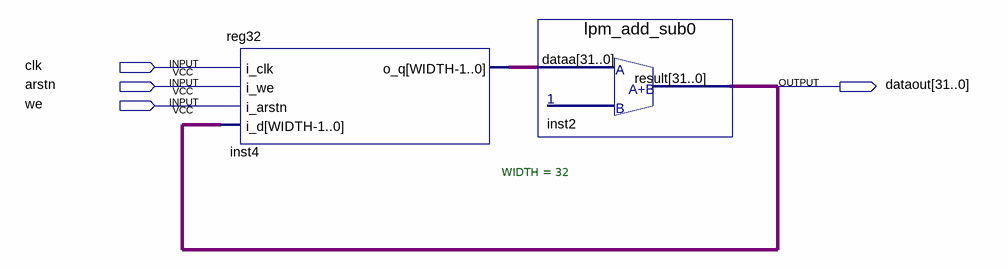
[diagram p0: schematic sheet]
// Quartus schematic sxema1.bdf as structural Verilog: 2 symbols, 4 pins
module sxema1 (
  input  clk,
  input  arstn,
  input  we,
  output [31:0] dataout
);

  wire [31:0] inst4_o_q;

  reg32 #(.WIDTH(32)) inst4 (.i_clk(clk), .i_we(arstn), .i_d(dataout), .i_arstn(we), .o_q(inst4_o_q));
  lpm_add_sub0 inst2 (.dataa(inst4_o_q), .result(dataout));
endmodule
